# EAGLE design FreeLSS_Board (EAGLE 6.6.0)
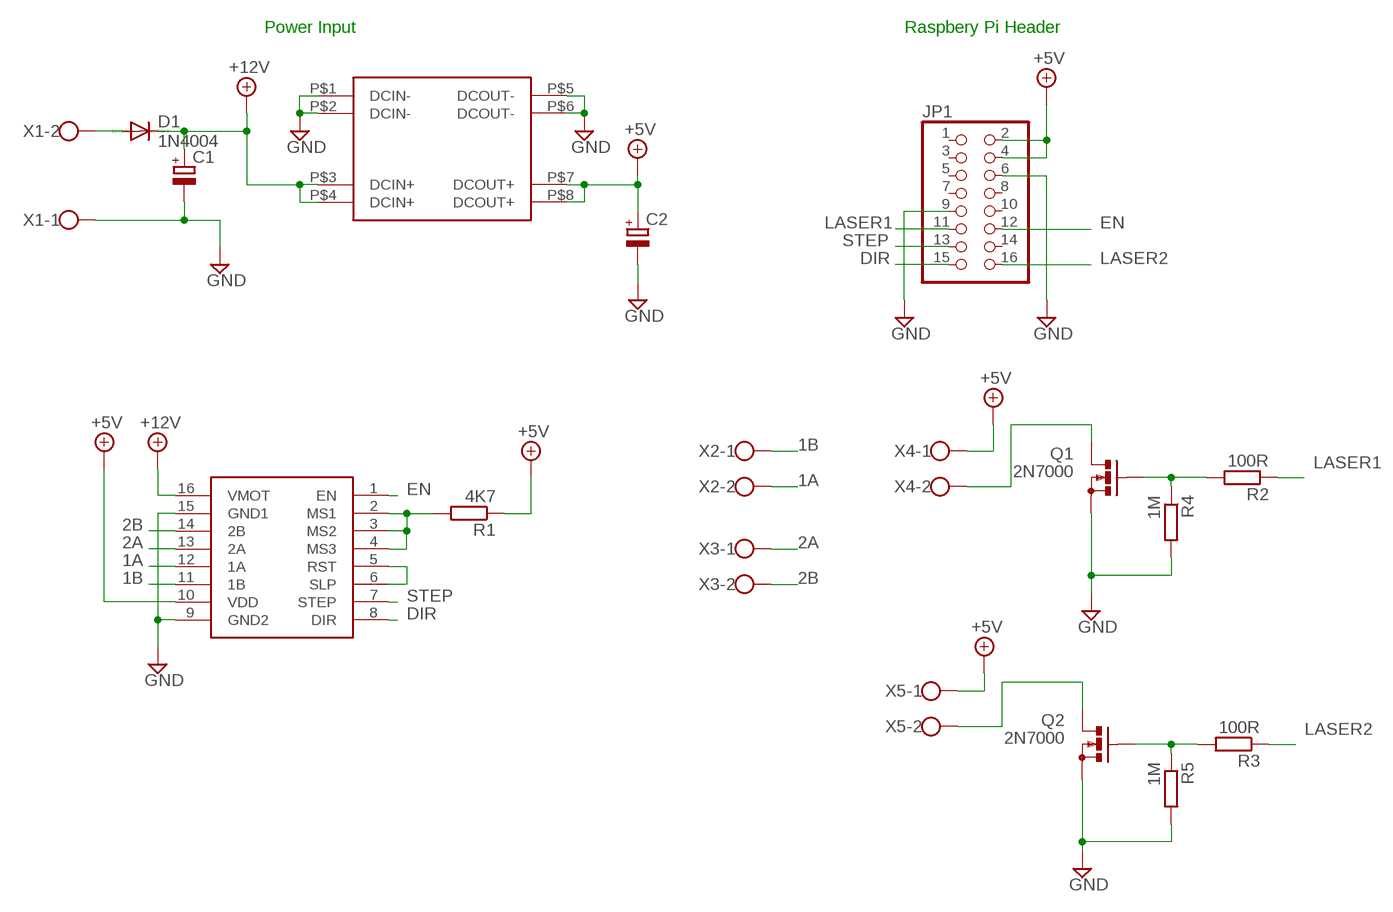
[diagram p0: schematic, sheet 1]

## Parts
C1  CPOL-EUE2.5-5  [E2,5-5]
C2  CPOL-EUE2.5-5  [E2,5-5]
D1  1N4004  1N4148DO35-7  [DO35-7]
JP1  PINHD-2X8  [2X08]
Q1  2N7000  BS170  [SOT54E]
Q2  2N7000  BS170  [SOT54E]
R1  4K7  R-EU_0204/7  [0204/7]
R2  100R  R-EU_0204/7  [0204/7]
R3  100R  R-EU_0204/7  [0204/7]
R4  1M  R-EU_0204/7  [0204/7]
R5  1M  R-EU_0204/7  [0204/7]
U$1  DC-DC_MODULE_MP1584  [DC-DC_MODULE_MP1584]
U$2  POLOLU_STEPSTICK  [POLOLU_STEPSTICK]
X1  W237-102  [W237-102]
X2  W237-102  [W237-102]
X3  W237-102  [W237-102]
X4  W237-102  [W237-102]
X5  W237-102  [W237-102]

## Nets
1A: U$2.12(1A) X2.2
1B: U$2.11(1B) X2.1
2A: U$2.13(2A) X3.1
2B: U$2.14(2B) X3.2
+5V: C2.+ JP1.2 JP1.4 R1.1 U$1.P$7(DCOUT+) U$1.P$8(DCOUT+) U$2.10(VDD) X4.1 X5.1
+12V: C1.+ D1.C U$1.P$3(DCIN+) U$1.P$4(DCIN+) U$2.16(VMOT)
DIR: JP1.15 U$2.8(DIR)
EN: JP1.12 U$2.1(EN)
GND: C1.- C2.- JP1.6 JP1.9 Q1.S Q2.S R4.2 R5.2 U$1.P$1(DCIN-) U$1.P$2(DCIN-) U$1.P$5(DCOUT-) U$1.P$6(DCOUT-) U$2.9(GND2) U$2.15(GND1) X1.1
LASER1: JP1.11 R2.1
LASER2: JP1.16 R3.1
N$1: D1.A X1.2
N$2: Q1.G R2.2 R4.1
N$3: Q2.G R3.2 R5.1
N$6: R1.2 U$2.2(MS1) U$2.3(MS2) U$2.4(MS3)
N$8: Q1.D X4.2
N$9: U$2.5(RST) U$2.6(SLP)
N$11: Q2.D X5.2
STEP: JP1.13 U$2.7(STEP)
Unconnected: JP1.1 JP1.3 JP1.5 JP1.7 JP1.8 JP1.10 JP1.14

## Notes on the sheet
- Power Input | Raspbery Pi Header

## Library data of the parts
C1 C2 = rcl:CPOL-EU: POLARIZED CAPACITOR, European symbol
D1 = diode:1N4148: DIODE high speed (Philips)
JP1 = pinhead:PINHD-2X8: PIN HEADER
Q1 Q2 = transistor-small-signal:BS170: N-CHANNEL MOS FET
R1-R5 = rcl:R-EU_: RESISTOR, European symbol
U$1 = CDR:DC-DC_MODULE_MP1584
U$2 = CDR:POLOLU_STEPSTICK
X1-X5 = con-wago-500:W237-102: WAGO SCREW CLAMP; MPN: 237-102; OC_FARNELL: unknown; OC_NEWARK: 70K9898

## Board
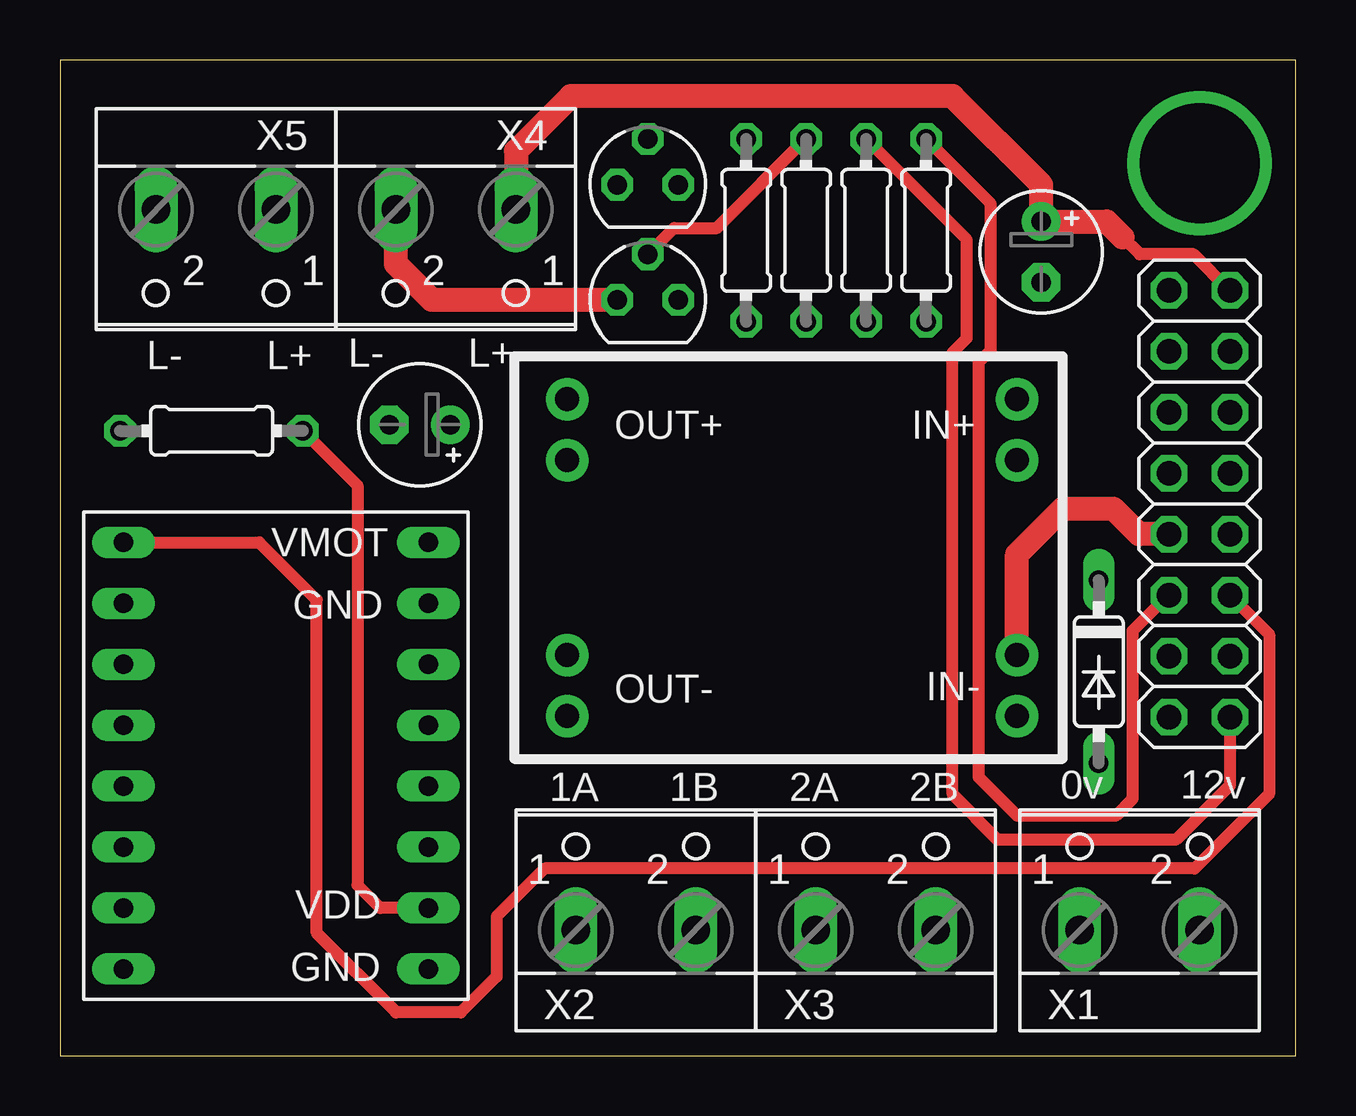
[diagram p1: board, top side]
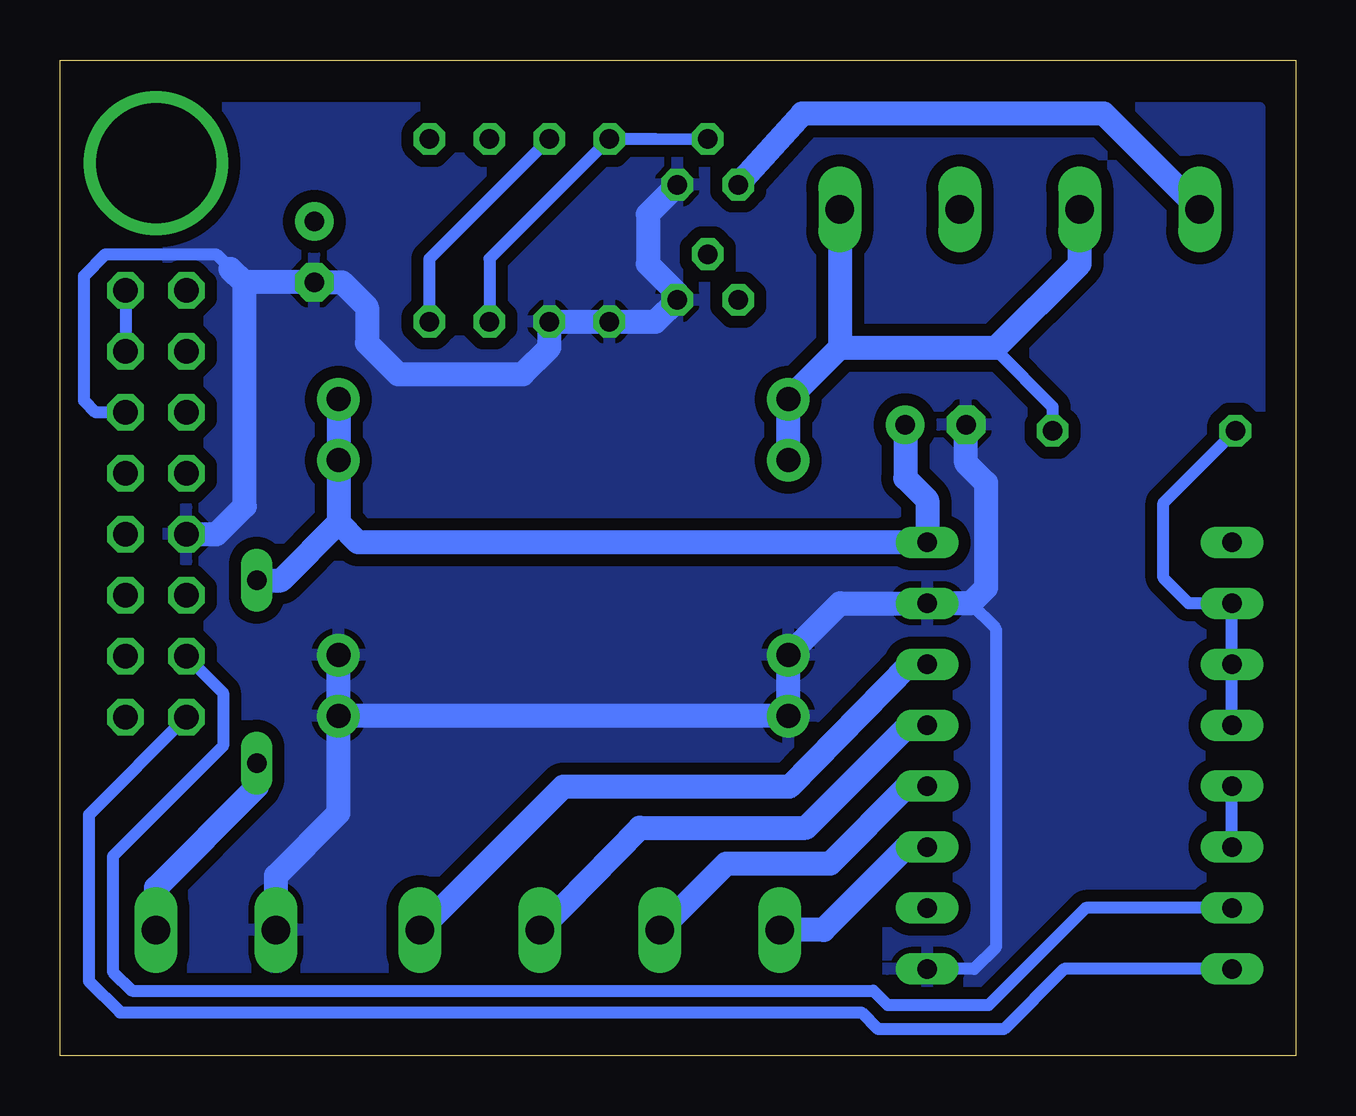
[diagram p2: board, bottom side, seen from below]

Size 51.5 x 41.5 mm. Coordinates in mm from the lower left corner, seen from the top.
Outline: 0,0 51.5,0 51.5,41.5 0,41.5 0,0
Copper layers (1*16): Top 0.035mm / dielectric 1.5mm / Bottom 0.035mm
Design rules "dirt_cheap_dirty_boards.v1": minimum track width 5mil, minimum drill 12mil, track to track 5mil, track to pad 5mil, pad to pad 5mil, via to via 5mil, smd to smd 0mil, copper to edge 10mil, drill to drill 10mil, minimum pad ring 10mil, minimum via ring 6mil, stop-mask expansion 2mil, vias tented up to drill 25mil, thermal gap 10mil

### Footprints (pad centres in the part's own frame; a part is rotated, then mirrored left to right if it is on the bottom)
E2,5-5 = drill 0.813 pad 1.6: + -1.27,0 | drill 0.813 pad 1.6 octagon: - 1.27,0
DO35-7 = drill 0.813 long: A 3.81,0; C -3.81,0
2X08 = drill 1.016 octagon: 1 -8.89,-1.27; 2 -8.89,1.27; 3 -6.35,-1.27; 4 -6.35,1.27; 5 -3.81,-1.27; 6 -3.81,1.27; 7 -1.27,-1.27; 8 -1.27,1.27; 9 1.27,-1.27; 10 1.27,1.27; 11 3.81,-1.27; 12 3.81,1.27; 13 6.35,-1.27; 14 6.35,1.27; 15 8.89,-1.27; 16 8.89,1.27
SOT54E = drill 0.813 octagon: D -1.27,0; G 0,1.905; S 1.27,0
0204/7 = drill 0.813 octagon: 1 -3.81,0; 2 3.81,0
DC-DC_MODULE_MP1584 = drill 1 pad 1.778: P$1 -8.89,6.35; P$2 -8.89,3.81; P$3 -8.89,-4.318; P$4 -8.89,-6.858; P$5 9.855,6.35; P$6 9.855,3.81; P$7 9.855,-4.318; P$8 9.855,-6.858
POLOLU_STEPSTICK = drill 0.813 long: 1 -6.35,8.89; 2 -6.35,6.35; 3 -6.35,3.81; 4 -6.35,1.27; 5 -6.35,-1.27; 6 -6.35,-3.81; 7 -6.35,-6.35; 8 -6.35,-8.89; 9 6.35,-8.89; 10 6.35,-6.35; 11 6.35,-3.81; 12 6.35,-1.27; 13 6.35,1.27; 14 6.35,3.81; 15 6.35,6.35; 16 6.35,8.89
W237-102 = drill 1.194 long: 1 -2.5,-1.27; 2 2.5,-1.27

### Placement (x,y rotation side)
C1  15,26.3 180 top
C2  40.9,33.5 270 top
D1  43.3,16 270 top
JP1  47.5,23 270 top
Q1  24.5,31.5 0 top
Q2  24.5,36.3 0 top
R1  6.32,26.04 180 top
R2  36.1,34.4 270 top
R3  33.6,34.4 270 top
R4  31.1,34.4 270 top
R5  28.6,34.4 270 top
U$1  31,20.5 180 top
U$2  9,12.5 0 top
X1  45,6.5 0 top
X2  24,6.5 0 top
X3  34,6.5 0 top
X4  16.5,34 180 top
X5  6.5,34 180 top

### Tracks (layer width: path | path; a pad name or v marks a point on that pad's centre or on a via)
1A
  Bottom 1: U$2.12 16.17,11.23 19.4,8 23.73,8 X2.2
1B
  Bottom 1: U$2.11 16.21,8.69 19.67,5.23 X2.1
2A
  Bottom 1: X3.1 27.33,9.5 20.4,9.5 16.13,13.77 U$2.13
2B
  Bottom 1: U$2.14 16.09,16.31 21.1,11.2 30.53,11.2 X3.2
+5V
  Top 0.5: R1.1 12.4,23.77 12.4,7.1 13.35,6.15 U$2.10 | JP1.2 47.26,33.4 45,33.4 44.3,34.1
  Top 1: 44.3,34.1 43.63,34.77 C2.+ 40.9,36.3 37.2,40 21.3,40 19,37.7 X4.1
  Bottom 0.3: 12.5,29.5 12.5,29.41
  Bottom 0.5: JP1.2 JP1.4 | 12.5,29.41 10.13,27.04 R1.1
  Bottom 1: U$1.P$7 U$1.P$8 19,29.5 | X5.1 9,33 12.5,29.5 19,29.5 | X4.1 19,29.5
+12V
  Bottom 1: U$1.P$4 U$1.P$3 39.89,22.21 | 16.27,21.39 U$2.16 | U$2.16 39.07,21.39 39.89,22.21 | C1.+ 16.27,24.07 15.35,23.15 U$2.16 | D1.C 42.29,19.81 39.89,22.21
DIR
  Bottom 0.5: JP1.15 50.3,10.04 50.3,3.1 49,1.8 18.1,1.8 17.4,1.1 12.16,1.1 9.65,3.61 U$2.8
EN
  Top 0.5: JP1.12 50.4,17.56 50.4,10.9 47.3,7.8 20.2,7.8 18.2,5.8 18.2,3.3 16.7,1.8 14,1.8 10.7,5.1 10.7,19 8.31,21.39 U$2.1
GND
  Top 1: U$1.P$2 39.89,20.89 41.8,22.8 43.9,22.8 44.97,21.73 JP1.9
  Bottom 0.5: 13.55,18.85 12.5,17.8 12.5,4.5 13.39,3.61 U$2.9 | JP1.6 50.01,26.81 50.5,27.3 50.5,32.5 49.6,33.4 45,33.4 44.4,32.8
  Bottom 1: X1.1 42.5,7.5 39.89,10.11 U$1.P$1 | U$1.P$1 U$1.P$2 | U$1.P$1 U$1.P$5 U$1.P$6 18.98,18.85 U$2.15 13.55,18.85 12.9,19.5 12.9,23.87 13.73,24.7 C1.- | 43.83,32.23 C2.- 39.74,32.23 38.7,31.19 38.7,29.7 37.4,28.4 32.22,28.4 31.1,29.52 R4.2 R5.2 26.68,30.59 Q1.S 25.8,31.8 27,33 27,35.07 Q2.S | 43.83,32.23 44.4,32.8 | 43.83,32.23 43.8,32.26 43.8,22.9 44.97,21.73 JP1.9
  pour Bottom (isolate 0.5): 1.5,39.5 47,39.5 47,1.5 24.1,1.4 24.1,8 17,8 17,1.5 1.5,1.5
LASER1
  Top 0.5: JP1.11 46.19,19.19 44.7,17.7 44.7,10.7 44,10 39.9,10 38.3,11.6 38.3,28.9 38.8,29.4 38.8,35.51 R2.1
LASER2
  Top 0.5: JP1.16 48.77,11.27 46.5,9 39.1,9 37.2,10.9 37.2,29.3 37.8,29.9 37.8,34.01 R3.1
N$1
  Bottom 1: X1.2 47.5,7 43.3,11.2 D1.A
N$2
  Top 0.5: Q1.G 25.59,34.5 27.39,34.5 R4.1
  Bottom 0.5: R2.2 36.1,33.21 R4.1
N$3
  Bottom 0.5: R3.2 33.6,33.21 R5.1 26.69,38.21 Q2.G
N$4  (via drill 5 pad 1.8)
  other vias: 47.5,37.2
N$6
  Bottom 0.5: U$2.4 U$2.3 U$2.2 4.45,18.85 5.51,19.91 5.51,23.04 R1.2
N$8
  Top 1: Q1.D 15.5,31.5 14,33 X4.2
N$9
  Bottom 0.5: U$2.6 U$2.5
N$11
  Bottom 1: X5.2 8,39.27 20.56,39.27 Q2.D
STEP
  Bottom 0.5: JP1.13 44.7,15.12 44.7,12.9 49.3,8.3 49.3,3.5 48.5,2.7 17.6,2.7 17,2.1 12.8,2.1 8.75,6.15 U$2.7

### Text on the board
tPlace: L- | L+ | L- | L+ | OUT+ | IN+ | VMOT | GND | OUT- | IN- | 1A | 1B | 2A | 2B | 0v | 12v | VDD | GND